# Altium schematic sheet Sheet1.SchDoc
size A0; SheetNumber: 1; SheetTotal: 1
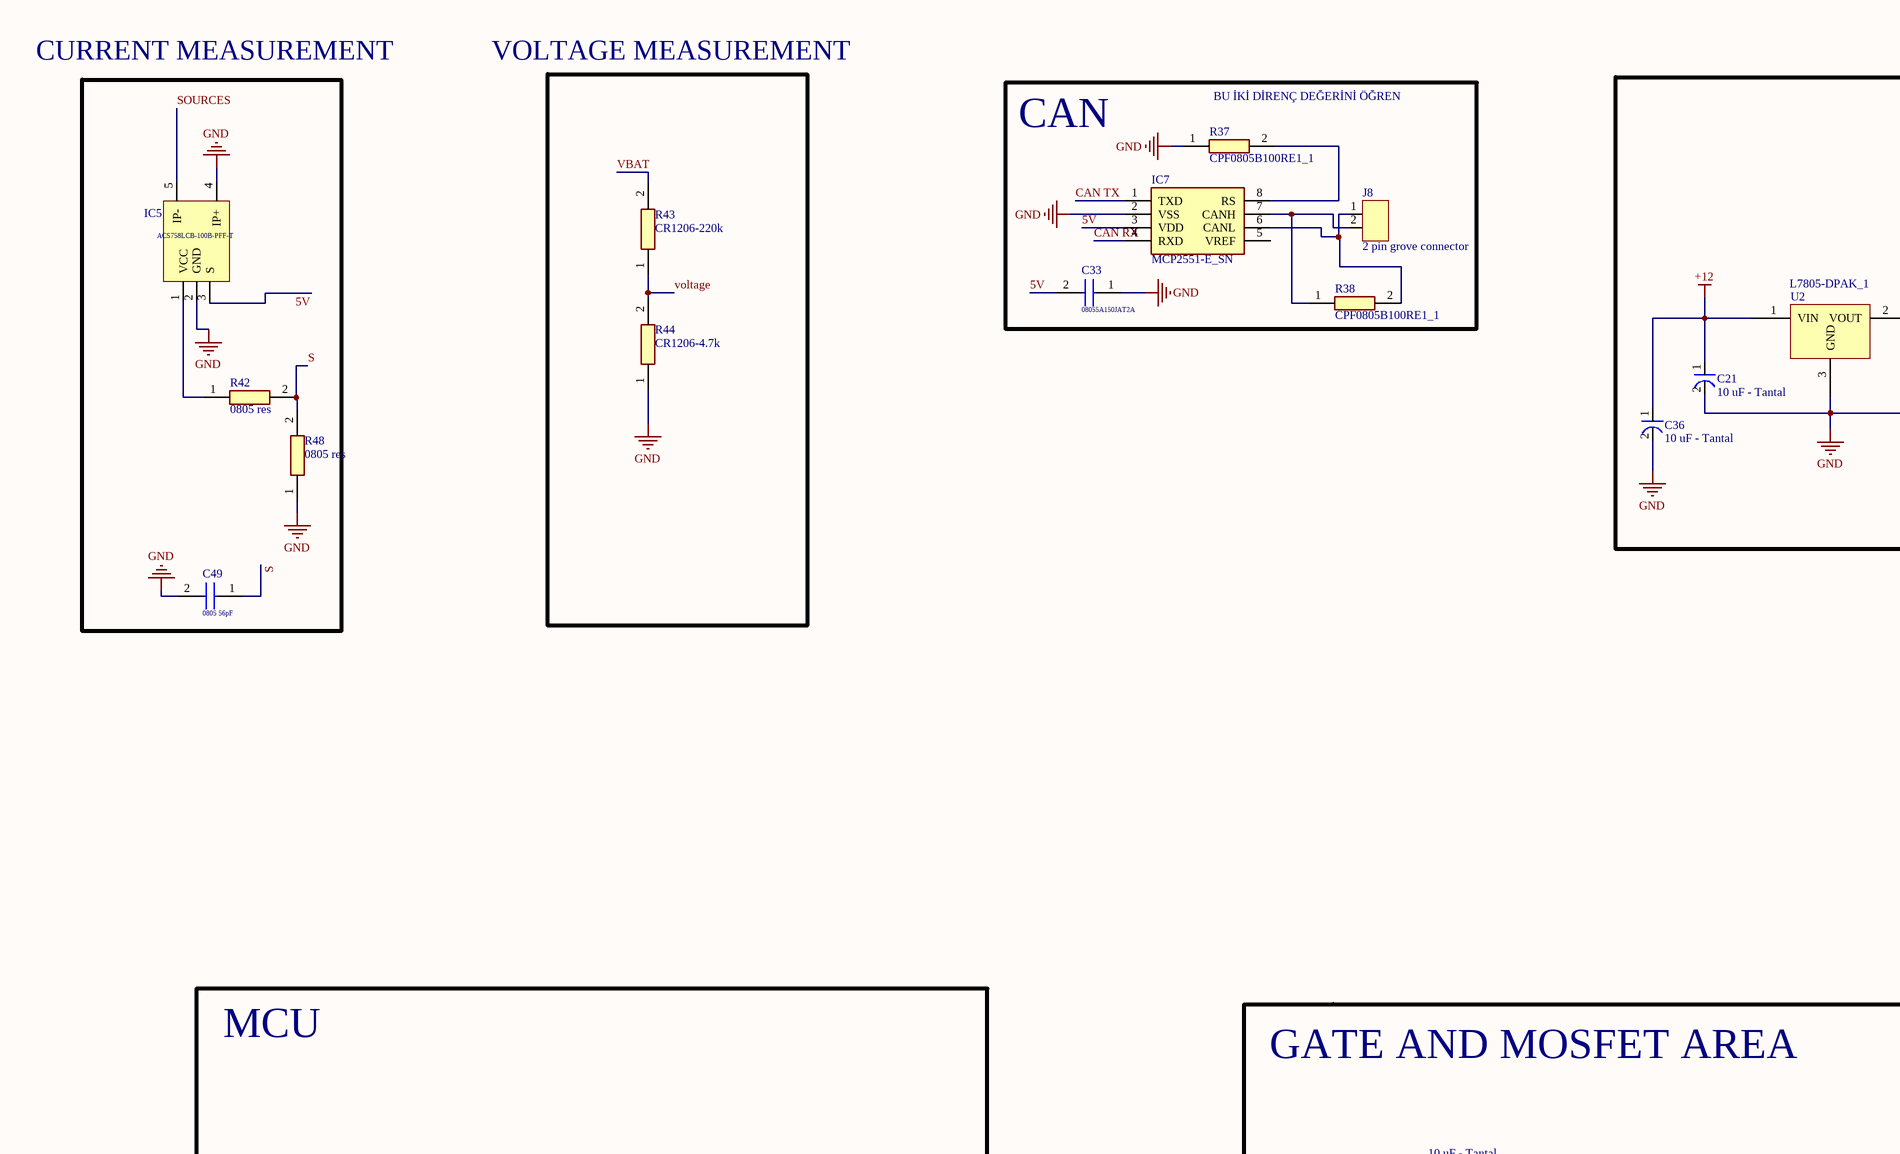
[diagram p0: Sheet1.SchDoc, top left]
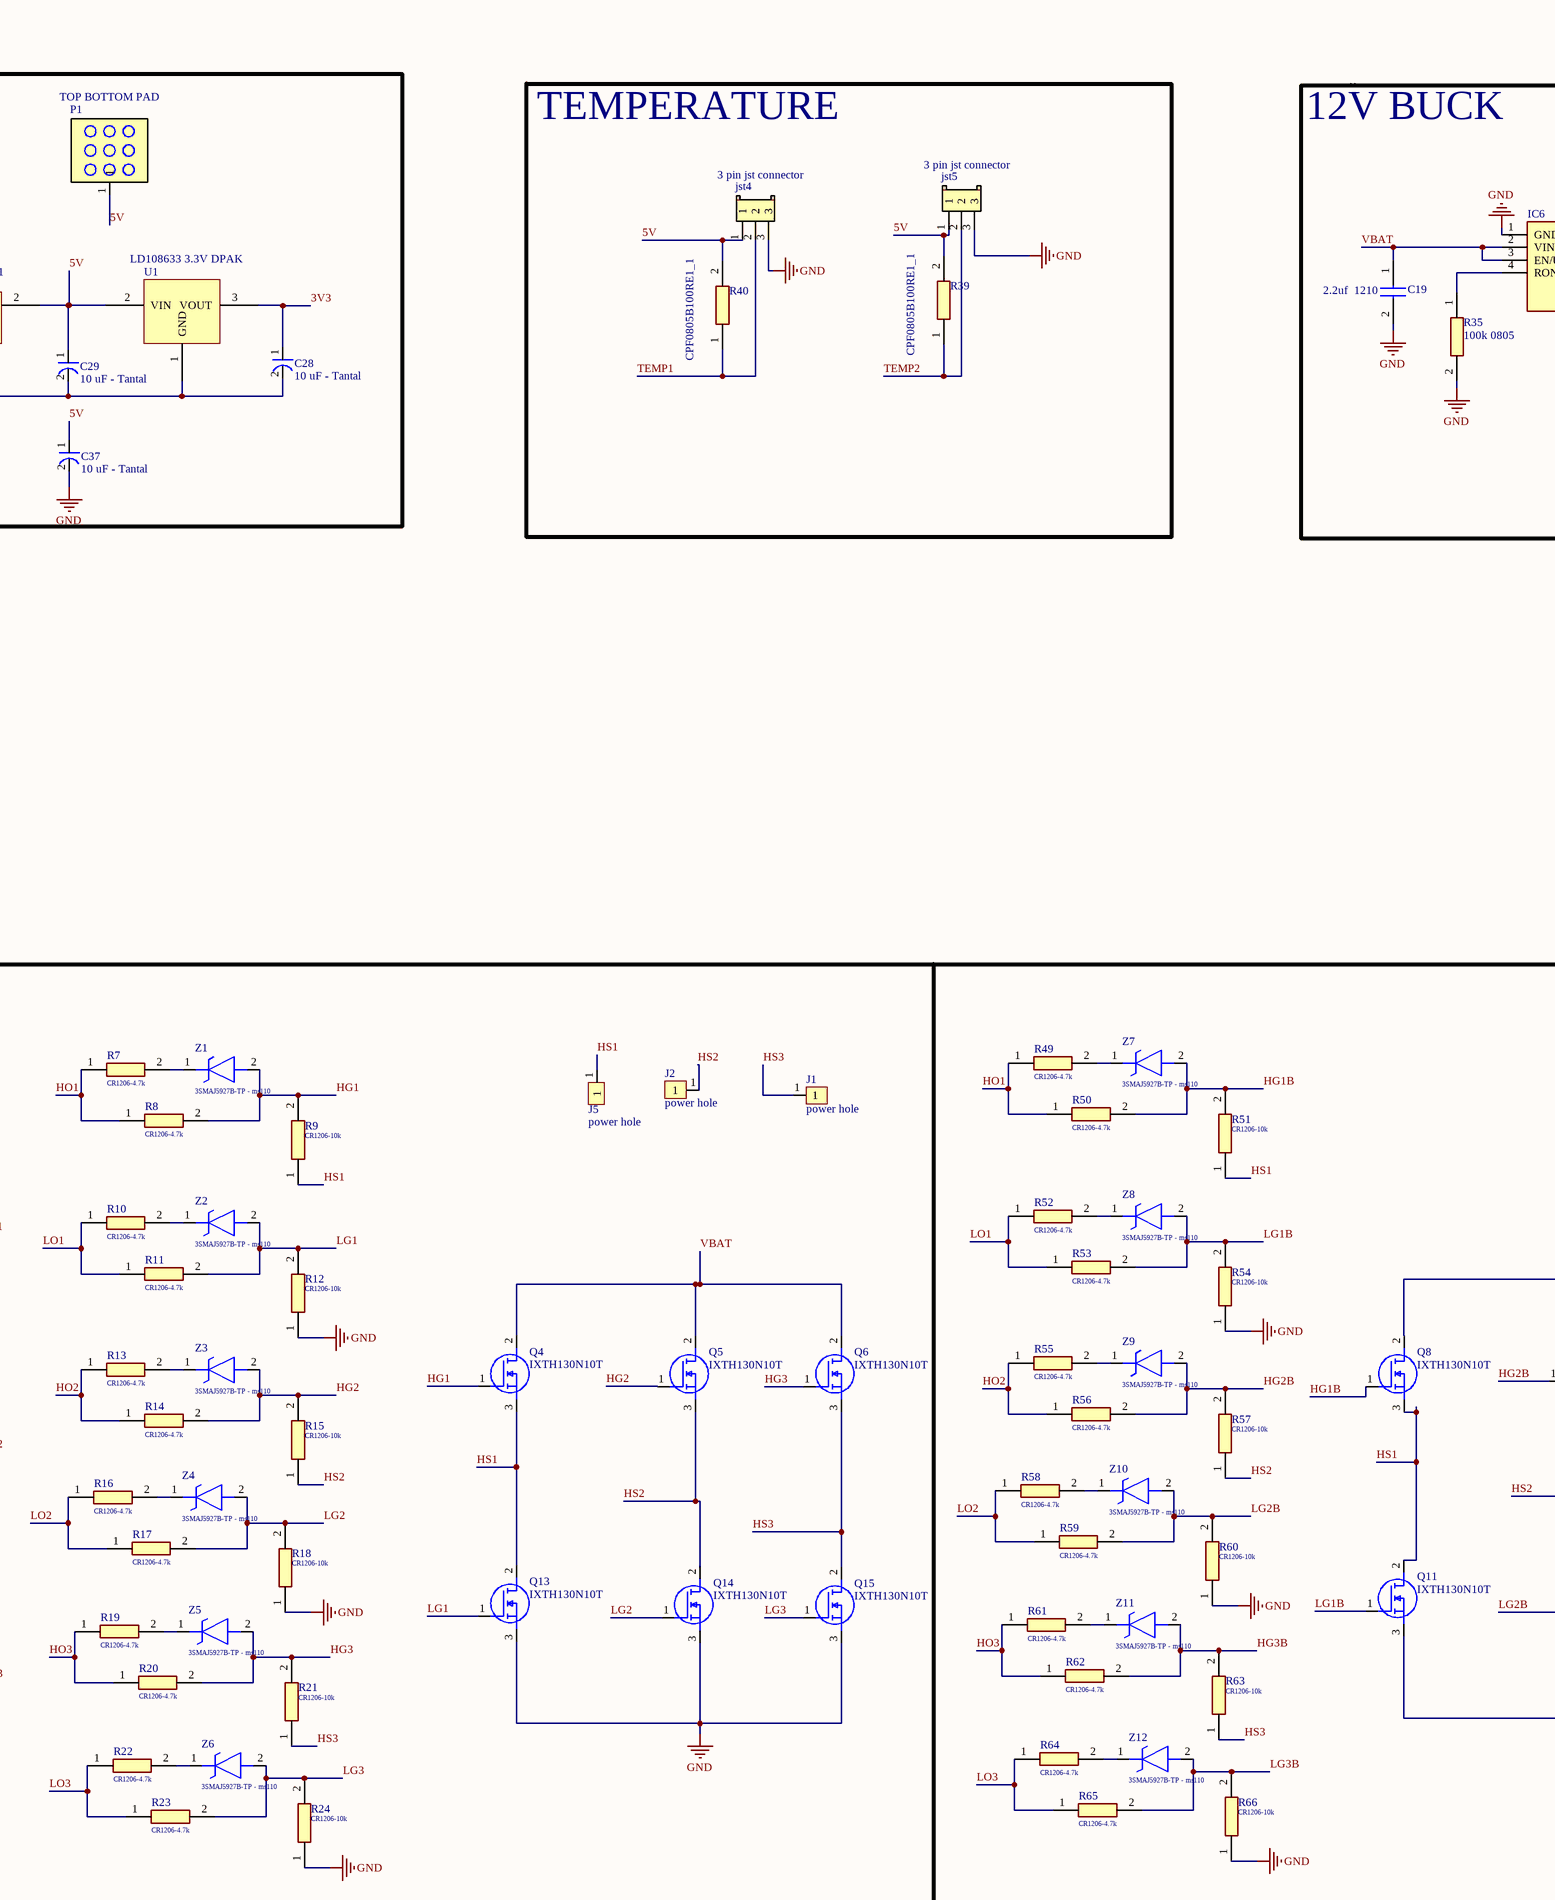
[diagram p1: Sheet1.SchDoc, top middle]
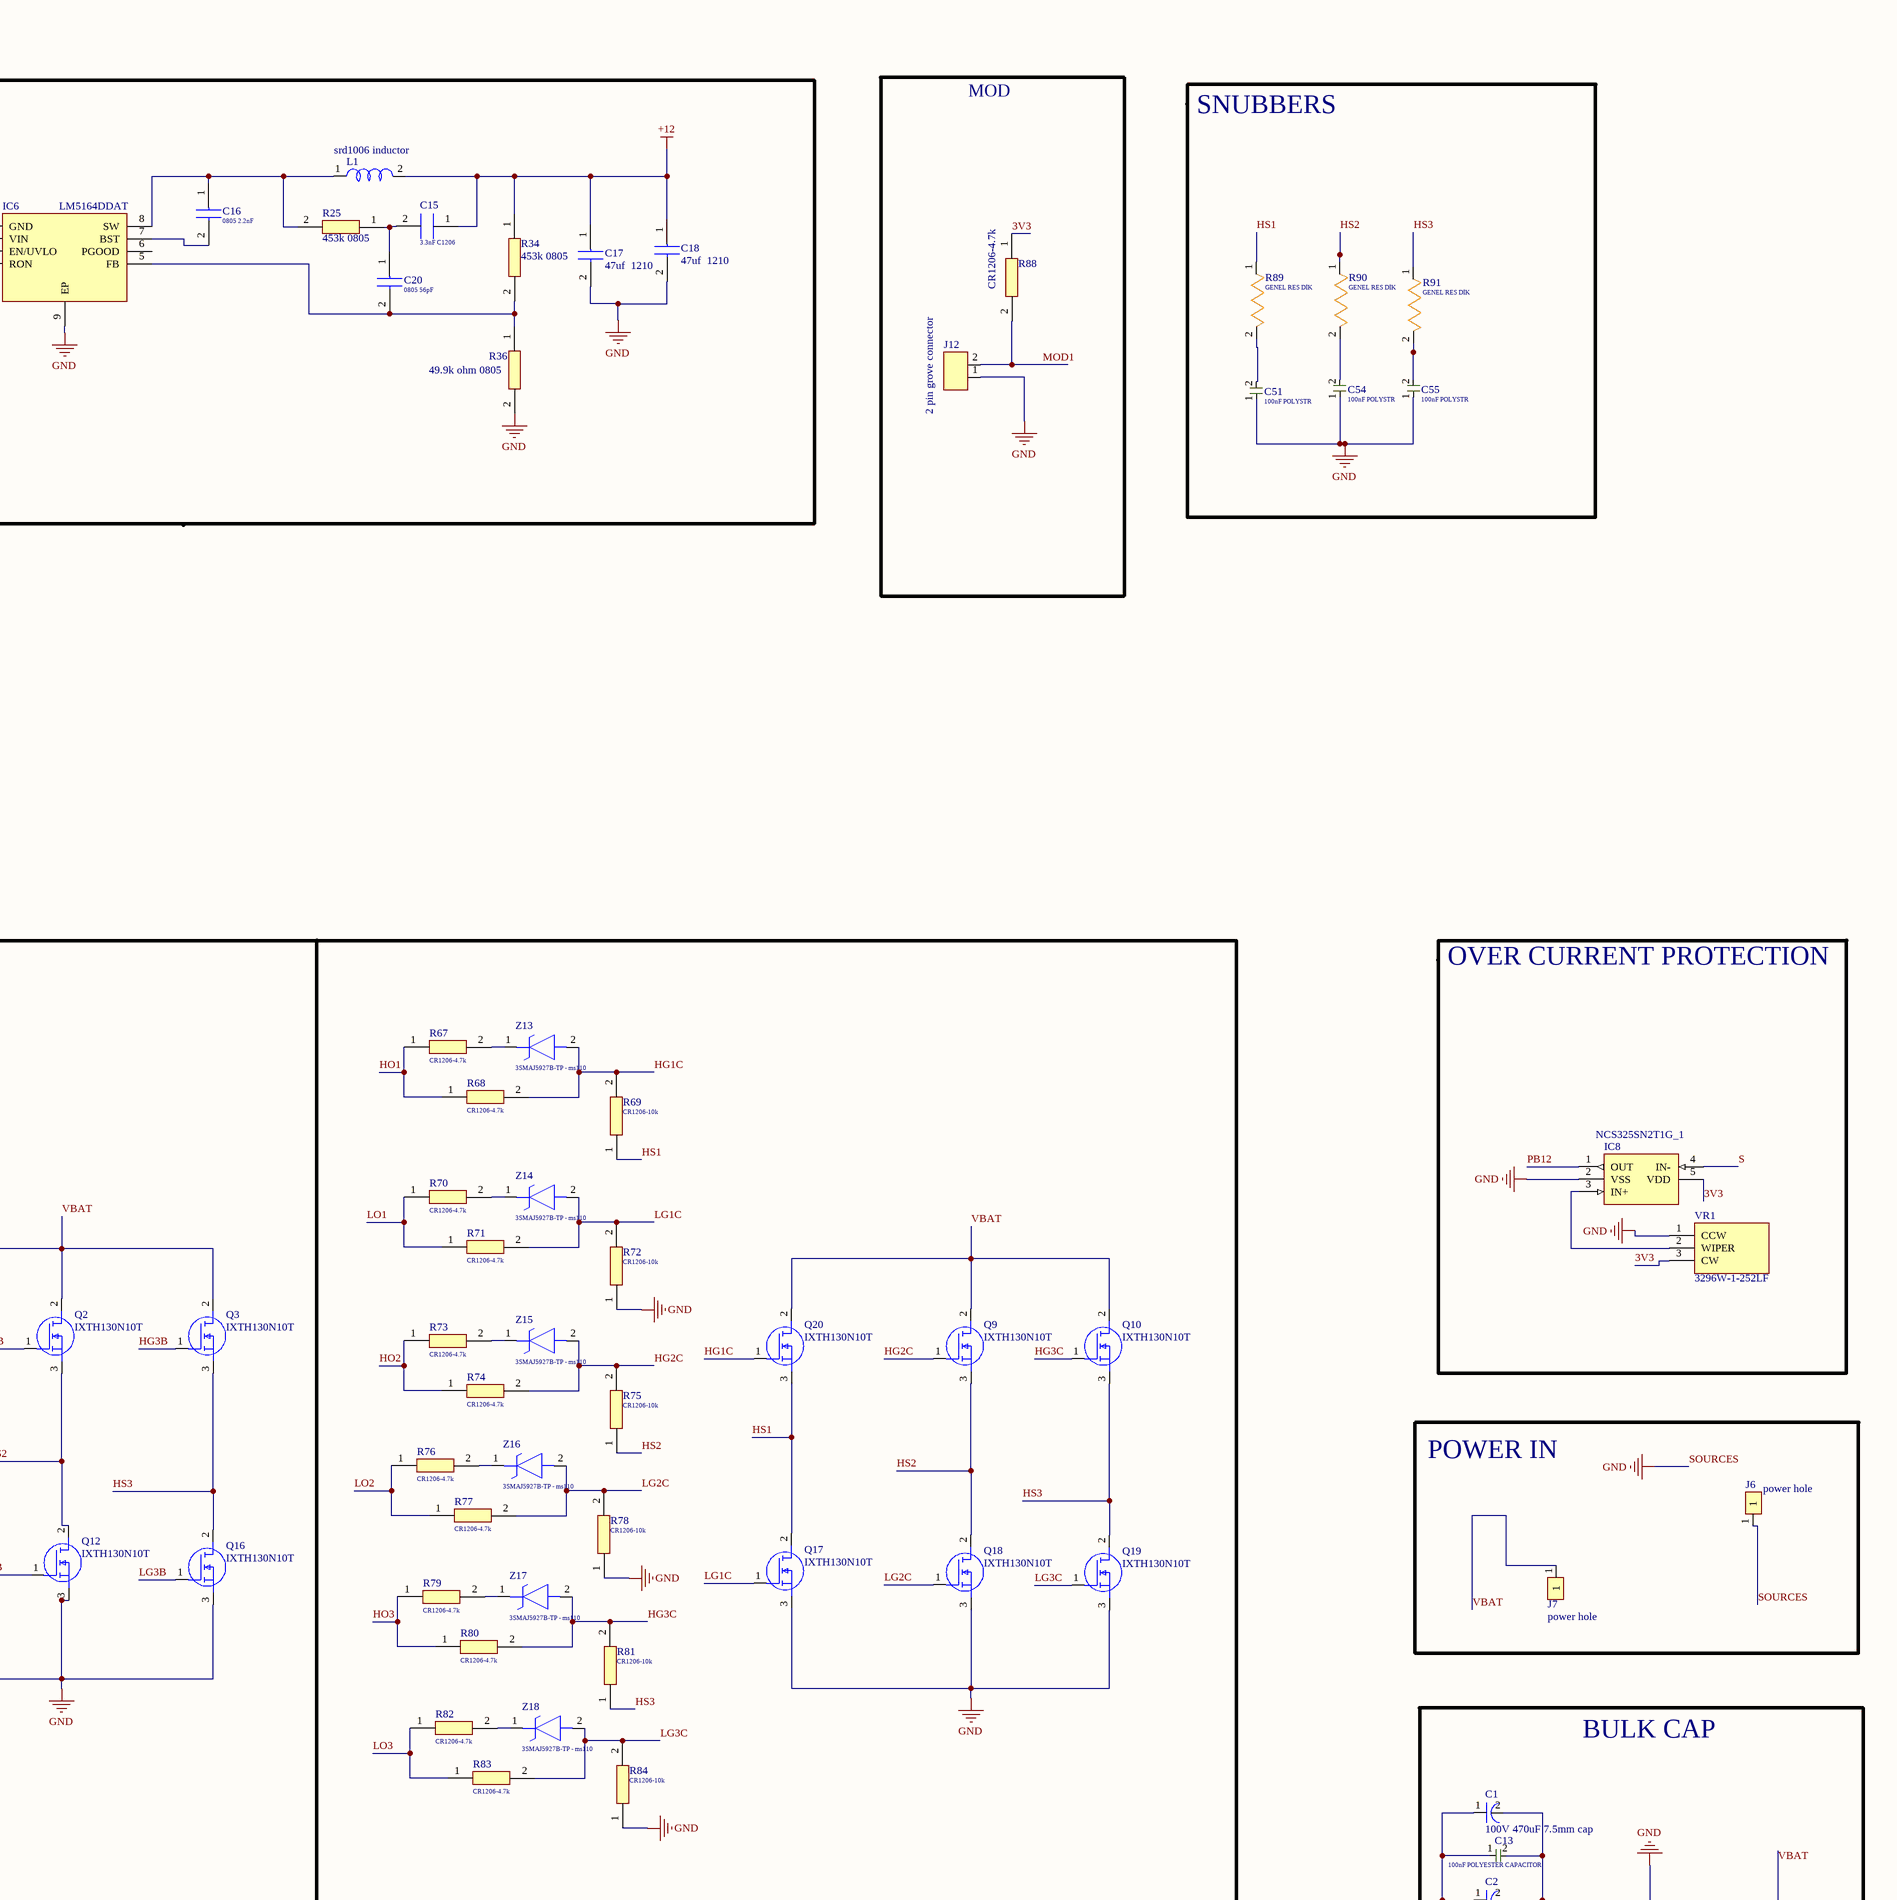
[diagram p2: Sheet1.SchDoc, top right]
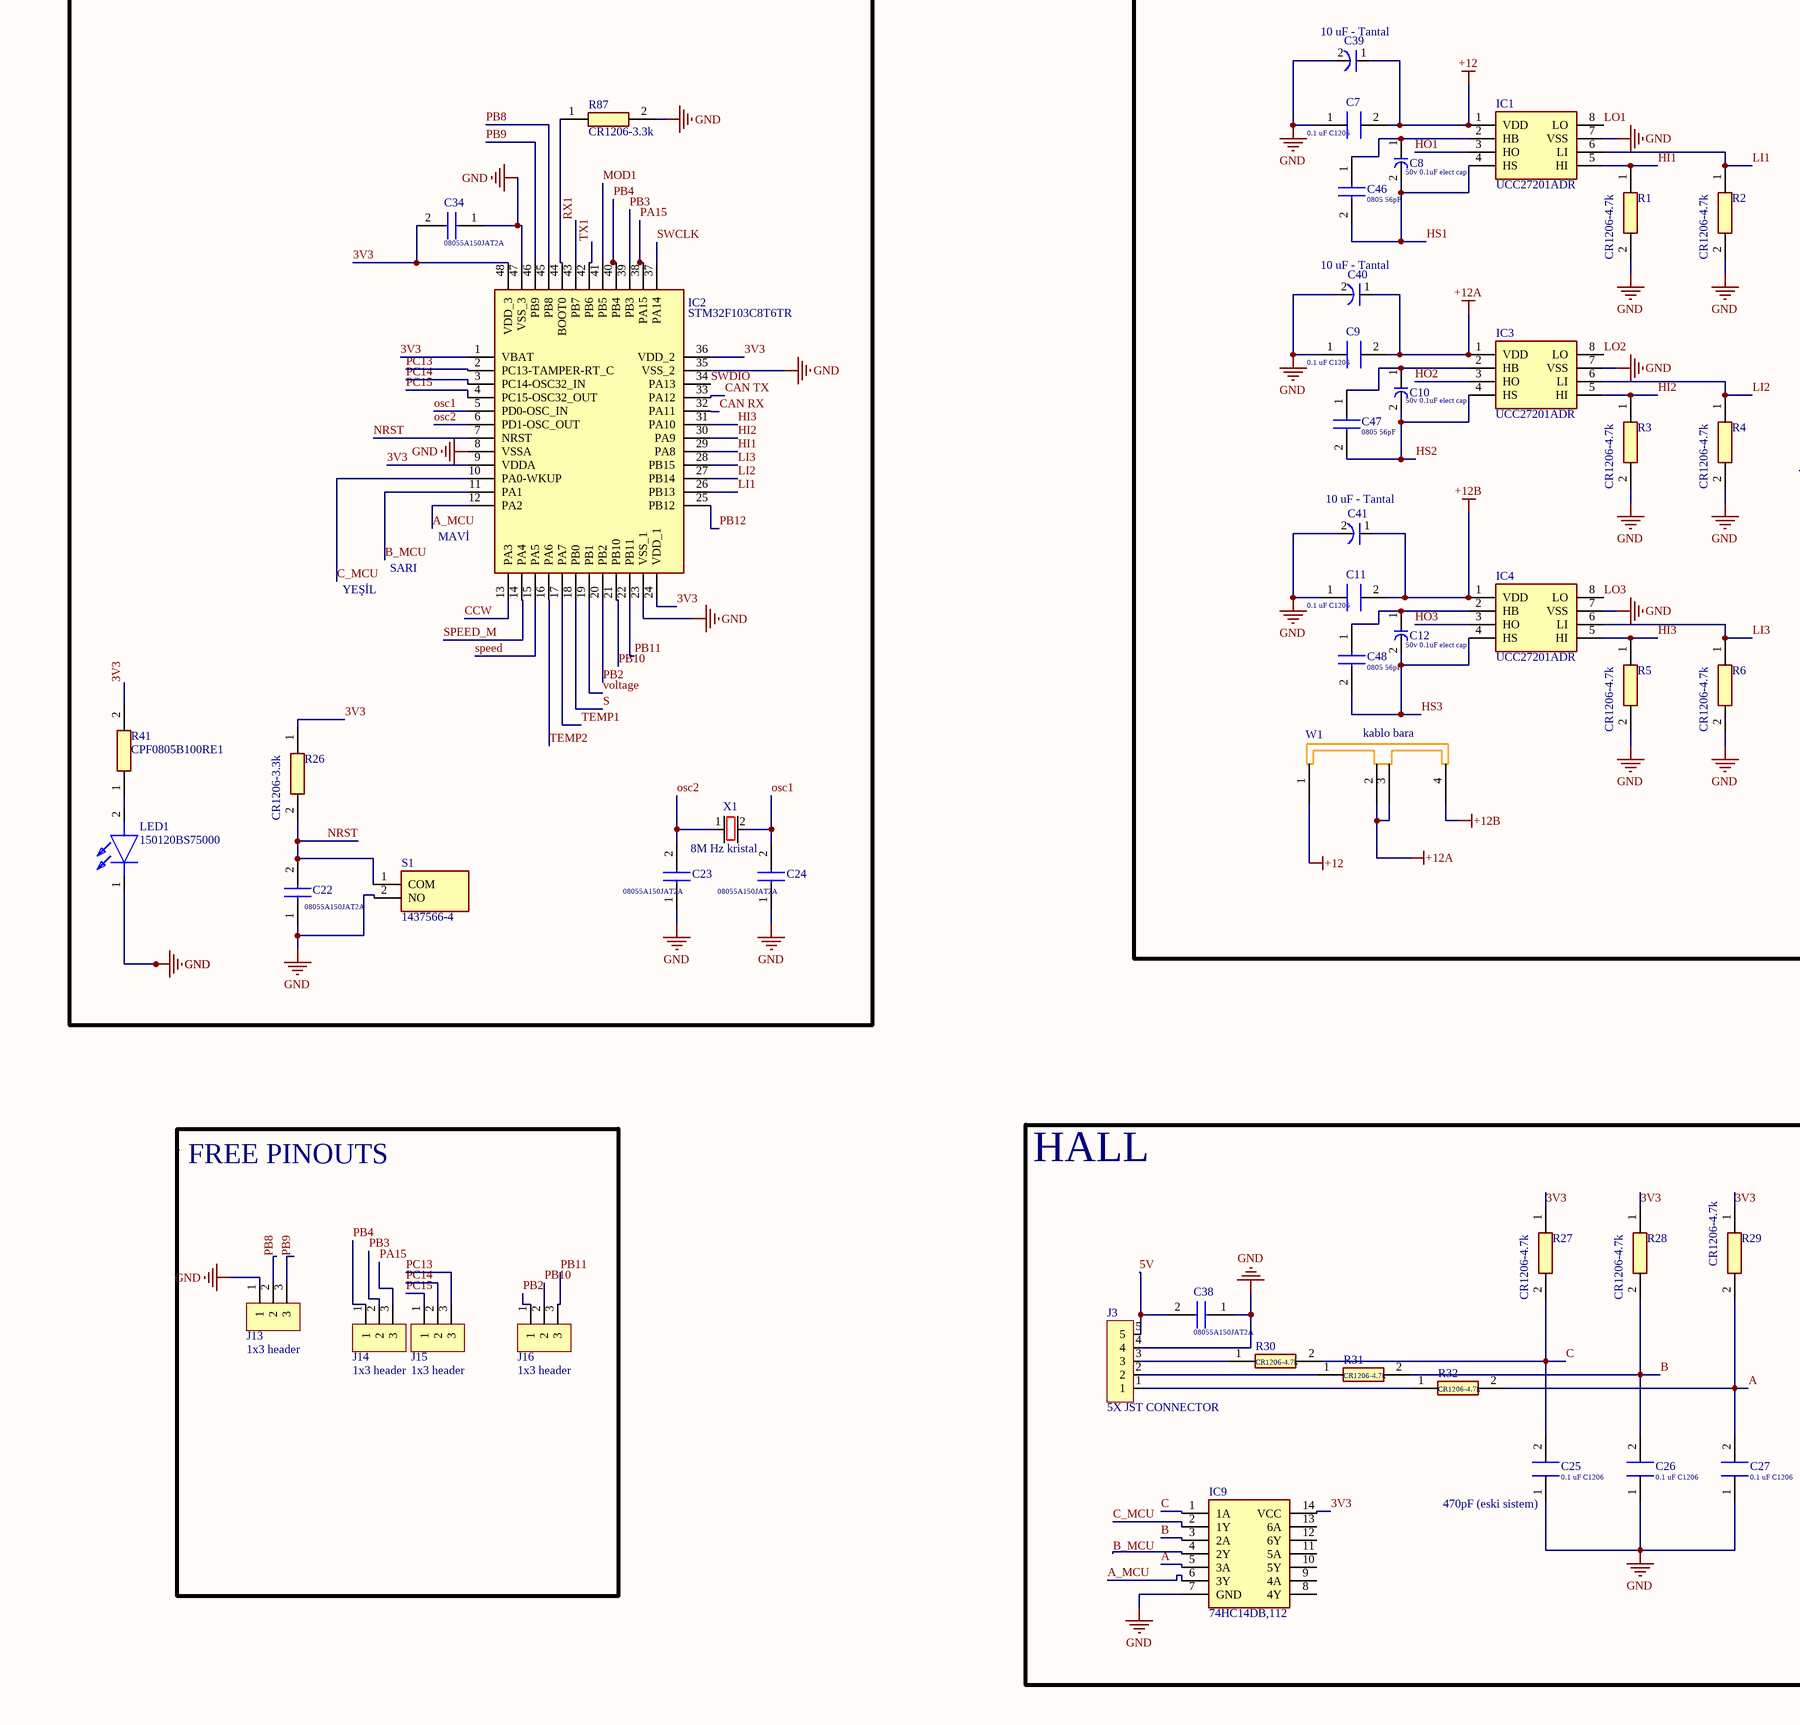
[diagram p3: Sheet1.SchDoc, bottom left]
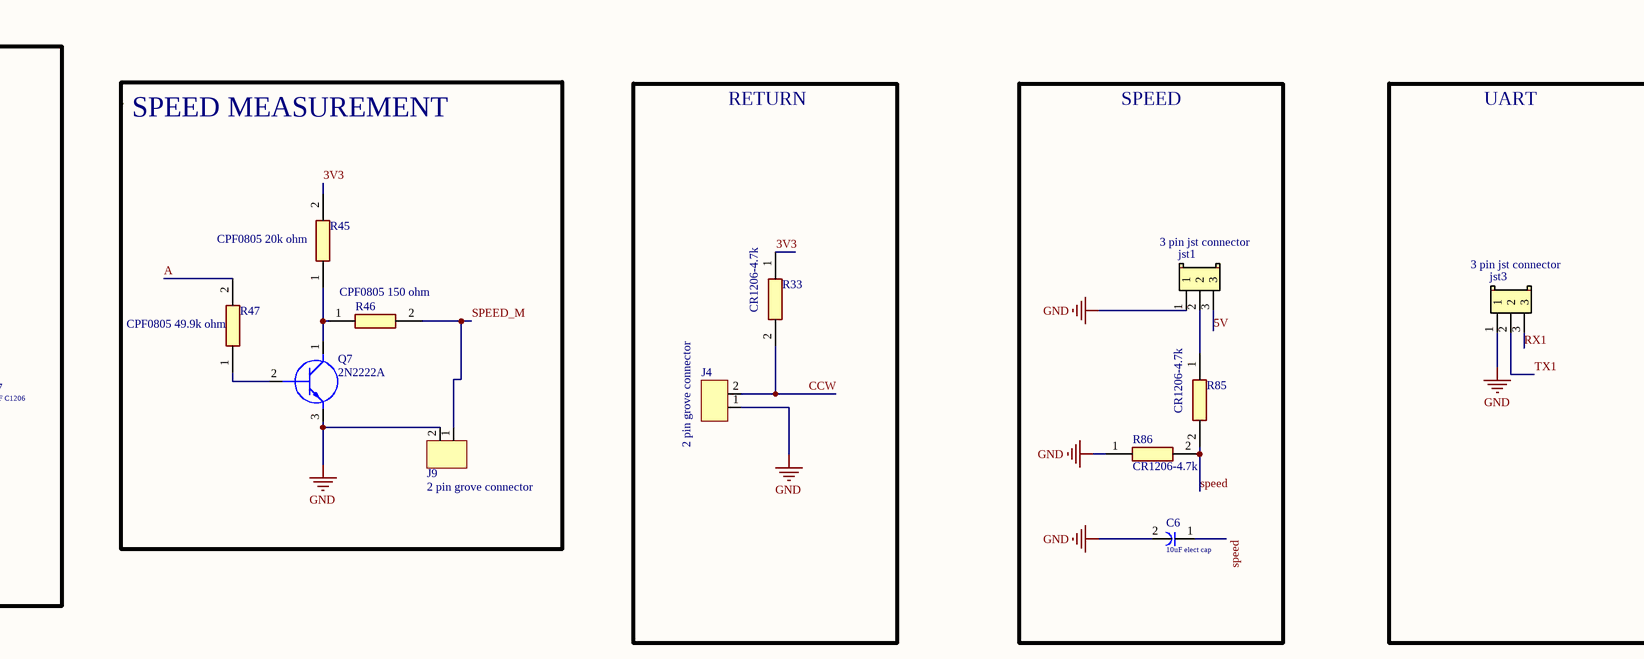
[diagram p4: Sheet1.SchDoc, bottom middle]
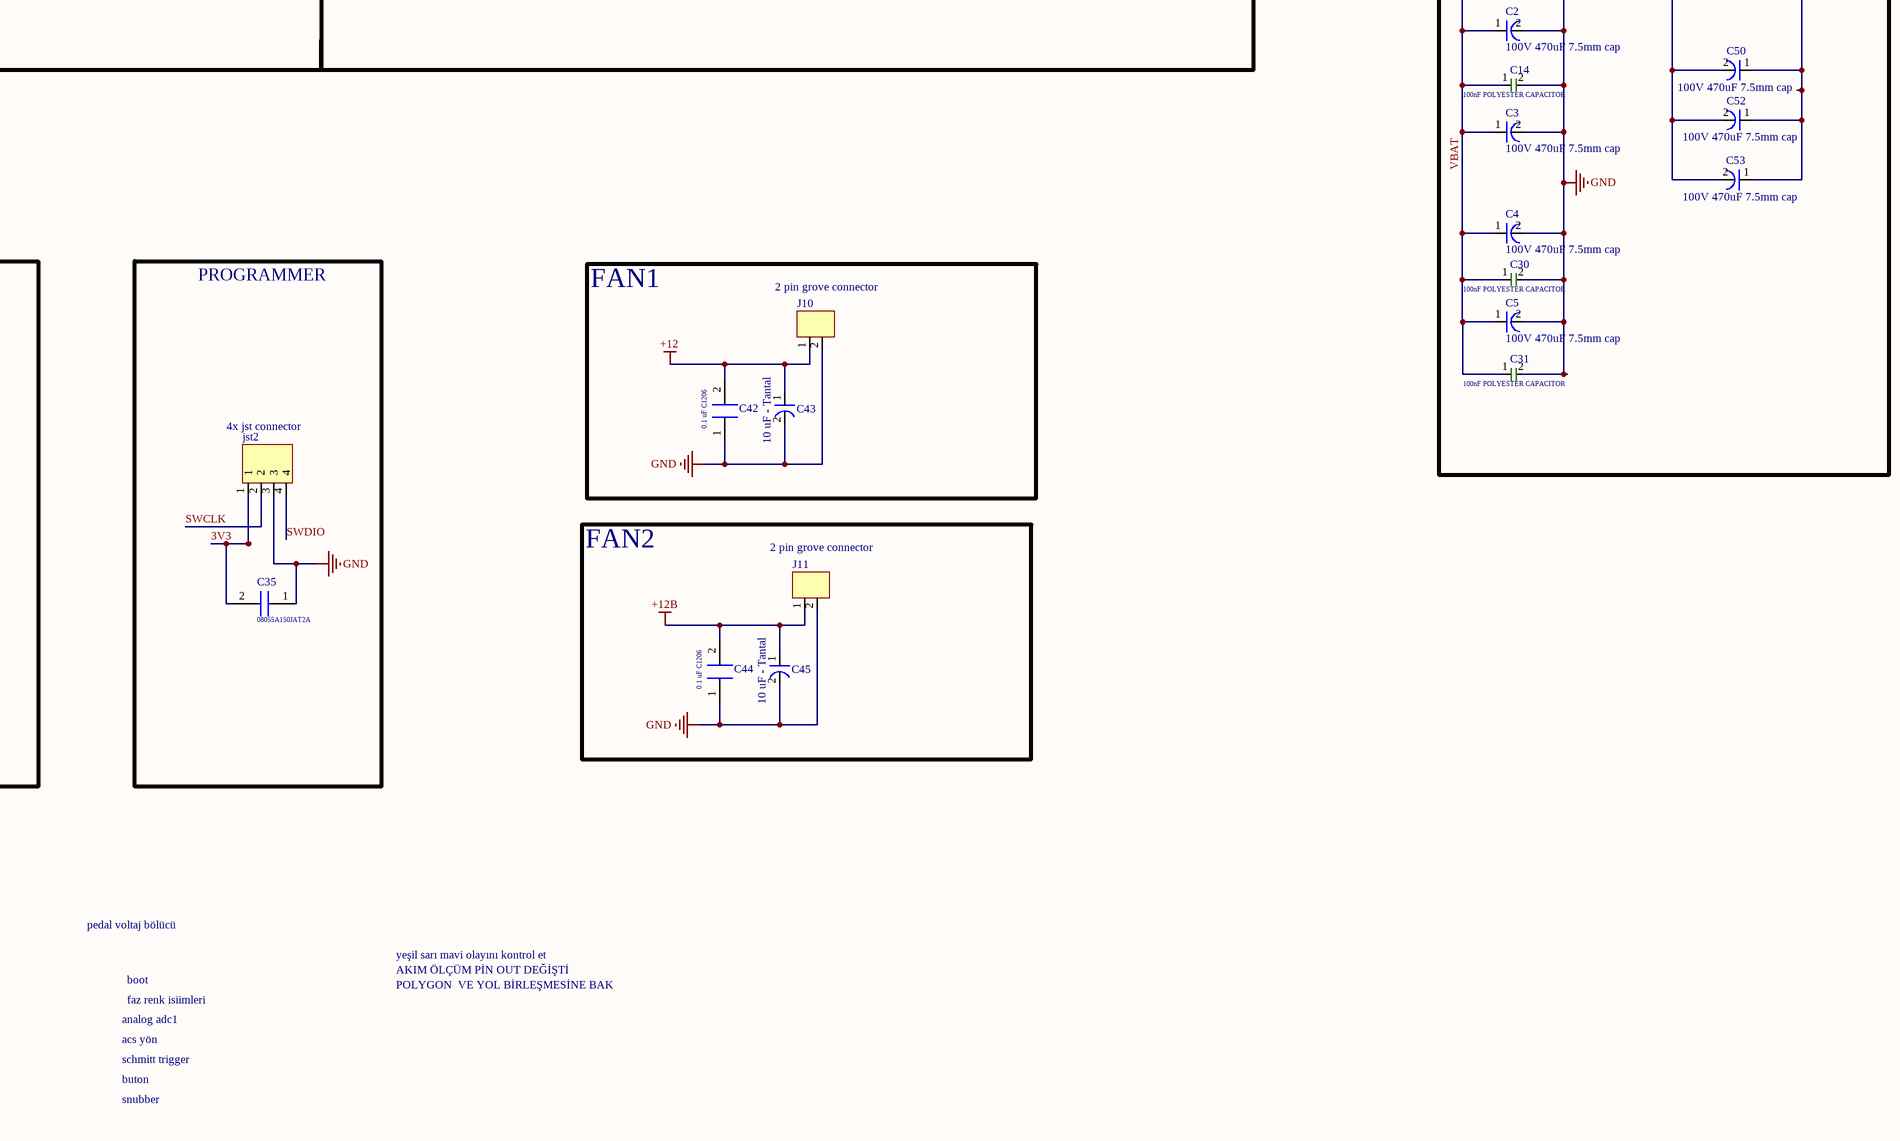
[diagram p5: Sheet1.SchDoc, bottom right]

## Parts
C1  100V 470uF 7.5mm cap  [100v 470UF]
C2  100V 470uF 7.5mm cap  [100v 470UF]
C3  100V 470uF 7.5mm cap  [100v 470UF]
C4  100V 470uF 7.5mm cap  [100v 470UF]
C5  100V 470uF 7.5mm cap  [100v 470UF]
C6  10uF elect cap  [50V 0.1uF elect cap]
C7  0.1 uF C1206  [C1206]
C8  50v 0.1uF elect cap  [50V 0.1uF elect cap]
C9  0.1 uF C1206  [C1206]
C10  50v 0.1uF elect cap  [50V 0.1uF elect cap]
C11  0.1 uF C1206  [C1206]
C12  50v 0.1uF elect cap  [50V 0.1uF elect cap]
C13  100nF POLYESTER CAPACITOR  [100uF POLYESTER CAPACITOR]
C14  100nF POLYESTER CAPACITOR  [100uF POLYESTER CAPACITOR]
C15  3.3nF C1206  [C1206]
C16  0805 2.2nF  [CAPC2012X94N]
C17  47uf  1210  [CAPC3225X270N]
C18  47uf  1210  [CAPC3225X270N]
C19  2.2uf  1210  [CAPC3225X270N]
C20  0805 56pF  [CAPC2012X94N]
C21  10 uF - Tantal  [C1206-TANT]
C22  08055A150JAT2A  [CAPC2012X94N]
C23  08055A150JAT2A  [CAPC2012X94N]
C24  08055A150JAT2A  [CAPC2012X94N]
C25  0.1 uF C1206  [C1206]
C26  0.1 uF C1206  [C1206]
C27  0.1 uF C1206  [C1206]
C28  10 uF - Tantal  [C1206-TANT]
C29  10 uF - Tantal  [C1206-TANT]
C30  100nF POLYESTER CAPACITOR  [100uF POLYESTER CAPACITOR]
C31  100nF POLYESTER CAPACITOR  [100uF POLYESTER CAPACITOR]
C33  08055A150JAT2A  [CAPC2012X94N]
C34  08055A150JAT2A  [CAPC2012X94N]
C35  08055A150JAT2A  [CAPC2012X94N]
C36  10 uF - Tantal  [C1206-TANT]
C37  10 uF - Tantal  [C1206-TANT]
C38  08055A150JAT2A  [CAPC2012X94N]
C39  10 uF - Tantal  [C1206-TANT]
C40  10 uF - Tantal  [C1206-TANT]
C41  10 uF - Tantal  [C1206-TANT]
C42  0.1 uF C1206  [C1206]
C43  10 uF - Tantal  [C1206-TANT]
C44  0.1 uF C1206  [C1206]
C45  10 uF - Tantal  [C1206-TANT]
C46  0805 56pF  [CAPC2012X94N]
C47  0805 56pF  [CAPC2012X94N]
C48  0805 56pF  [CAPC2012X94N]
C49  0805 56pF  [CAPC2012X94N]
C50  100V 470uF 7.5mm cap  [100v 470UF]
C51  100nF POLYSTR  [100uF POLYESTER CAPACITOR]
C52  100V 470uF 7.5mm cap  [100v 470UF]
C53  100V 470uF 7.5mm cap  [100v 470UF]
C54  100nF POLYSTR  [100uF POLYESTER CAPACITOR]
C55  100nF POLYSTR  [100uF POLYESTER CAPACITOR]
IC1  UCC27201ADR  [SOIC127P600X175-8N]
IC2  STM32F103C8T6TR  [QFP50P900X900X160-48N]
IC3  UCC27201ADR  [SOIC127P600X175-8N]
IC4  UCC27201ADR  [SOIC127P600X175-8N]
IC5  ACS758LCB-100B-PFF-T  [ACS772ECB200BPFFT]
IC6  LM5164DDAT  [SOIC127P600X170-9N]
IC7  MCP2551-E_SN  [SOIC127P600X175-8N]
IC8  NCS325SN2T1G_1  [SOT95P275X110-5N]
IC9  74HC14DB,112  [SOIC127P600X175-14N]
J1  power hole  [power hole metric5]
J2  power hole  [power hole metric5]
J3  5X JST CONNECTOR  [5X HEADER]
J4  2 pin grove connector  [2 pin grove connector]
J5  power hole  [power hole metric5]
J6  power hole  [power hole metric5]
J7  power hole  [power hole metric5]
J8  2 pin grove connector  [2 pin grove connector]
J9  2 pin grove connector  [2 pin grove connector]
J10  2 pin grove connector  [2 pin grove connector]
J11  2 pin grove connector  [2 pin grove connector]
J12  2 pin grove connector  [2 pin grove connector]
J13  1x3 header  [1x3 header]
J14  1x3 header  [1x3 header]
J15  1x3 header  [1x3 header]
J16  1x3 header  [1x3 header]
jst1  3 pin jst connector  [3 pin jst connector]
jst2  4x jst connector  [4x jst connector]
jst3  3 pin jst connector  [3 pin jst connector]
jst4  3 pin jst connector  [3 pin jst connector]
jst5  3 pin jst connector  [3 pin jst connector]
L1  srd1006 inductor  [srd1006]
LED1  150120BS75000  [LEDC3214X78N]
P1  TOP BOTTOM PAD  [TOP BOTTOM PAD]
Q2  IXTH130N10T  [IXTH130N10T]
Q3  IXTH130N10T  [IXTH130N10T]
Q4  IXTH130N10T  [IXTH130N10T]
Q5  IXTH130N10T  [IXTH130N10T]
Q6  IXTH130N10T  [IXTH130N10T]
Q7  2N2222A  [2N2222A]
Q8  IXTH130N10T  [IXTH130N10T]
Q9  IXTH130N10T  [IXTH130N10T]
Q10  IXTH130N10T  [IXTH130N10T]
Q11  IXTH130N10T  [IXTH130N10T]
Q12  IXTH130N10T  [IXTH130N10T]
Q13  IXTH130N10T  [IXTH130N10T]
Q14  IXTH130N10T  [IXTH130N10T]
Q15  IXTH130N10T  [IXTH130N10T]
Q16  IXTH130N10T  [IXTH130N10T]
Q17  IXTH130N10T  [IXTH130N10T]
Q18  IXTH130N10T  [IXTH130N10T]
Q19  IXTH130N10T  [IXTH130N10T]
Q20  IXTH130N10T  [IXTH130N10T]
R1  CR1206-4.7k  [RESC3216X75N]
R2  CR1206-4.7k  [RESC3216X75N]
R3  CR1206-4.7k  [RESC3216X75N]
R4  CR1206-4.7k  [RESC3216X75N]
R5  CR1206-4.7k  [RESC3216X75N]
R6  CR1206-4.7k  [RESC3216X75N]
R7  CR1206-4.7k  [RESC3216X75N]
R8  CR1206-4.7k  [RESC3216X75N]
R9  CR1206-10k  [RESC3216X75N]
R10  CR1206-4.7k  [RESC3216X75N]
R11  CR1206-4.7k  [RESC3216X75N]
R12  CR1206-10k  [RESC3216X75N]
R13  CR1206-4.7k  [RESC3216X75N]
R14  CR1206-4.7k  [RESC3216X75N]
R15  CR1206-10k  [RESC3216X75N]
R16  CR1206-4.7k  [RESC3216X75N]
R17  CR1206-4.7k  [RESC3216X75N]
R18  CR1206-10k  [RESC3216X75N]
R19  CR1206-4.7k  [RESC3216X75N]
R20  CR1206-4.7k  [RESC3216X75N]
R21  CR1206-10k  [RESC3216X75N]
R22  CR1206-4.7k  [RESC3216X75N]
R23  CR1206-4.7k  [RESC3216X75N]
R24  CR1206-10k  [RESC3216X75N]
R25  453k 0805  [RESC2012X65N]
R26  CR1206-3.3k  [RESC3216X75N]
R27  CR1206-4.7k  [RESC3216X75N]
R28  CR1206-4.7k  [RESC3216X75N]
R29  CR1206-4.7k  [RESC3216X75N]
R30  CR1206-4.7k  [RESC3216X75N]
R31  CR1206-4.7k  [RESC3216X75N]
R32  CR1206-4.7k  [RESC3216X75N]
R33  CR1206-4.7k  [RESC3216X75N]
R34  453k 0805  [RESC2012X65N]
R35  100k 0805  [RESC2012X65N]
R36  49.9k ohm 0805  [RESC2012X65N]
R37  CPF0805B100RE1_1  [RESC2012X65N]
R38  CPF0805B100RE1_1  [RESC2012X65N]
R39  CPF0805B100RE1_1  [RESC2012X65N]
R40  CPF0805B100RE1_1  [RESC2012X65N]
R41  CPF0805B100RE1  [RESC2012X65N]
R42  0805 res  [RESC2012X65N]
R43  CR1206-220k  [RESC3216X75N]
R44  CR1206-4.7k  [RESC3216X75N]
R45  CPF0805 20k ohm  [RESC2012X65N]
R46  CPF0805 150 ohm  [RESC2012X65N]
R47  CPF0805 49.9k ohm  [RESC2012X65N]
R48  0805 res  [RESC2012X65N]
R49  CR1206-4.7k  [RESC3216X75N]
R50  CR1206-4.7k  [RESC3216X75N]
R51  CR1206-10k  [RESC3216X75N]
R52  CR1206-4.7k  [RESC3216X75N]
R53  CR1206-4.7k  [RESC3216X75N]
R54  CR1206-10k  [RESC3216X75N]
R55  CR1206-4.7k  [RESC3216X75N]
R56  CR1206-4.7k  [RESC3216X75N]
R57  CR1206-10k  [RESC3216X75N]
R58  CR1206-4.7k  [RESC3216X75N]
R59  CR1206-4.7k  [RESC3216X75N]
R60  CR1206-10k  [RESC3216X75N]
R61  CR1206-4.7k  [RESC3216X75N]
R62  CR1206-4.7k  [RESC3216X75N]
R63  CR1206-10k  [RESC3216X75N]
R64  CR1206-4.7k  [RESC3216X75N]
R65  CR1206-4.7k  [RESC3216X75N]
R66  CR1206-10k  [RESC3216X75N]
R67  CR1206-4.7k  [RESC3216X75N]
R68  CR1206-4.7k  [RESC3216X75N]
R69  CR1206-10k  [RESC3216X75N]
R70  CR1206-4.7k  [RESC3216X75N]
R71  CR1206-4.7k  [RESC3216X75N]
R72  CR1206-10k  [RESC3216X75N]
R73  CR1206-4.7k  [RESC3216X75N]
R74  CR1206-4.7k  [RESC3216X75N]
R75  CR1206-10k  [RESC3216X75N]
R76  CR1206-4.7k  [RESC3216X75N]
R77  CR1206-4.7k  [RESC3216X75N]
R78  CR1206-10k  [RESC3216X75N]
R79  CR1206-4.7k  [RESC3216X75N]
R80  CR1206-4.7k  [RESC3216X75N]
R81  CR1206-10k  [RESC3216X75N]
R82  CR1206-4.7k  [RESC3216X75N]
R83  CR1206-4.7k  [RESC3216X75N]
R84  CR1206-10k  [RESC3216X75N]
R85  CR1206-4.7k  [RESC3216X75N]
R86  CR1206-4.7k  [RESC3216X75N]
R87  CR1206-3.3k  [RESC3216X75N]
R88  CR1206-4.7k  [RESC3216X75N]
R89  GENEL RES DİK  [DİK GENEL RES THT]
R90  GENEL RES DİK  [DİK GENEL RES THT]
R91  GENEL RES DİK  [DİK GENEL RES THT]
S1  1437566-4  [14375664]
U1  LD108633 3.3V DPAK  [DPAK228P972X240-3N]
U2  L7805-DPAK_1  [DPAK228P972X240-3N]
VR1  3296W-1-252LF  [3296W-1]
W1  kablo bara  [KABLO BARA]
X1  8M Hz kristal  [8M Hz kristal]
Z1  3SMAJ5927B-TP - ms110  [DIOM5226X244N]
Z2  3SMAJ5927B-TP - ms110  [DIOM5226X244N]
Z3  3SMAJ5927B-TP - ms110  [DIOM5226X244N]
Z4  3SMAJ5927B-TP - ms110  [DIOM5226X244N]
Z5  3SMAJ5927B-TP - ms110  [DIOM5226X244N]
Z6  3SMAJ5927B-TP - ms110  [DIOM5226X244N]
Z7  3SMAJ5927B-TP - ms110  [DIOM5226X244N]
Z8  3SMAJ5927B-TP - ms110  [DIOM5226X244N]
Z9  3SMAJ5927B-TP - ms110  [DIOM5226X244N]
Z10  3SMAJ5927B-TP - ms110  [DIOM5226X244N]
Z11  3SMAJ5927B-TP - ms110  [DIOM5226X244N]
Z12  3SMAJ5927B-TP - ms110  [DIOM5226X244N]
Z13  3SMAJ5927B-TP - ms110  [DIOM5226X244N]
Z14  3SMAJ5927B-TP - ms110  [DIOM5226X244N]
Z15  3SMAJ5927B-TP - ms110  [DIOM5226X244N]
Z16  3SMAJ5927B-TP - ms110  [DIOM5226X244N]
Z17  3SMAJ5927B-TP - ms110  [DIOM5226X244N]
Z18  3SMAJ5927B-TP - ms110  [DIOM5226X244N]

## Blocks framed on the sheet
CAN: C33 IC7 J8 R37 R38
TEMPERATURE: jst4 jst5 R39 R40
MOD: J12 R88
SNUBBERS: C51 C54 C55 R89-R91
MCU: C22-C24 C34 IC2 LED1 R26 R41 R87 S1 X1
GATE AND MOSFET AREA: C7-C12 C39-C41 C46-C48 IC1 IC3 IC4 J1 J2 J5 Q4-Q6 Q13-Q15 R1-R24 W1 Z1-Z6
OVER CURRENT PROTECTION: IC8 VR1
POWER IN: J6 J7
BULK CAP: C1-C5 C13 C14 C30 C31 C50 C52 C53
FREE PINOUTS: J13-J16
HALL: C25-C27 C38 IC9 J3 R27-R32
SPEED MEASUREMENT: J9 Q7 R45-R47
RETURN: J4 R33
SPEED: C6 jst1 R85 R86
UART: jst3
PROGRAMMER: C35 jst2
FAN1: C42 C43 J10
FAN2: C44 C45 J11

## Nets
+12: C7.2 C15.1 C17.1 C18.1 C21.1 C36.1 C39.1 C42.2 C43.1 IC1.1(VDD) J10.1 L1.2 R34.1 U2.1(VIN) W1.1
+12A: C9.2 C40.1 IC3.1(VDD) W1.2 W1.3
+12B: C11.2 C41.1 C44.2 C45.1 IC4.1(VDD) J11.1 W1.4
SOURCES: C1.2 C2.2 C3.2 C4.2 C5.2 C6.2 C7.1 C9.1 C11.1 C13.2 C14.2 C17.2 C18.2 C19.2 C21.2 C22.1 C23.1 C24.1 C25.1 C26.1 C27.1 C28.2 C29.2 C30.2 C31.2 C33.1 C34.1 C35.1 C36.2 C37.2 C38.1 C39.2 C40.2 C41.2 C42.1 C43.2 C44.1 C45.2 C49.2 C50.2 C51.1 C52.2 C53.2 C54.1 C55.1 IC1.7(VSS) IC2.8(VSSA) IC2.23(VSS_1) IC2.35(VSS_2) IC2.47(VSS_3) IC3.7(VSS) IC4.7(VSS) IC5.2(GND) IC5.4(IP+) IC5.5(IP-) IC6.1(GND) IC6.9(EP) IC7.2(VSS) IC8.2(VSS) IC9.7(GND) J3.4 J4.1 J6.1 J9.2 J10.2 J11.2 J12.1 J13.1 jst1.1 jst2.3 jst3.1 jst4.3 jst5.3 LED1.1(K) Q7.3(E) Q11.3(S) Q12.3(S) Q13.3(S) Q14.3(S) Q15.3(S) Q16.3(S) Q17.3(S) Q18.3(S) Q19.3(S) R1.2 R2.2 R3.2 R4.2 R5.2 R6.2 R12.1 R18.1 R24.1 R35.2 R36.2 R37.1 R44.1 R48.1 R54.1 R60.1 R66.1 R72.1 R78.1 R84.1 R86.1 R87.2 S1.2(NO) U1.1(GND) U2.3(GND) VR1.1(CCW)  [also labelled GND]
3V3: C28.1 C34.2 C35.2 IC2.1(VBAT) IC2.9(VDDA) IC2.24(VDD_1) IC2.36(VDD_2) IC2.48(VDD_3) IC8.5(VDD) IC9.14(VCC) jst2.1 R26.1 R27.1 R28.1 R29.1 R33.1 R41.2 R45.2 R88.1 U1.3(VOUT) VR1.3(CW)
5V: C29.1 C33.2 C37.1 C38.2 IC5.3(S) IC7.3(VDD) J3.5 jst1.3 jst4.1 jst5.1 P1.1 R39.2 R40.2 U1.2(VIN) U2.2(VOUT)
A: C27.2 IC9.5(3A) R29.2 R32.2 R47.2
A_MCU: IC2.12(PA2) IC9.6(3Y)
B: C26.2 IC9.3(2A) R28.2 R31.2
B_MCU: IC2.11(PA1) IC9.4(2Y)
C: C25.2 IC9.1(1A) R27.2 R30.2
C_MCU: IC2.10(PA0-WKUP) IC9.2(1Y)
CAN RX: IC2.32(PA11) IC7.4(RXD)
CAN TX: IC2.33(PA12) IC7.1(TXD)
CCW: IC2.13(PA3) J4.2 R33.2
HG1: Q4.1(G) R8.2 R9.2 Z1.2(A)
HG1B: Q8.1(G) R50.2 R51.2 Z7.2(A)
HG1C: Q20.1(G) R68.2 R69.2 Z13.2(A)
HG2: Q5.1(G) R14.2 R15.2 Z3.2(A)
HG2B: Q2.1(G) R56.2 R57.2 Z9.2(A)
HG2C: Q9.1(G) R74.2 R75.2 Z15.2(A)
HG3: Q6.1(G) R20.2 R21.2 Z5.2(A)
HG3B: Q3.1(G) R62.2 R63.2 Z11.2(A)
HG3C: Q10.1(G) R80.2 R81.2 Z17.2(A)
HI1: IC1.5(HI) IC2.29(PA8) R1.1
HI2: IC2.30(PA9) IC3.5(HI) R3.1
HI3: IC2.31(PA10) IC4.5(HI) R5.1
HO1: IC1.3(HO) R7.1 R8.1 R49.1 R50.1 R67.1 R68.1
HO2: IC3.3(HO) R13.1 R14.1 R55.1 R56.1 R73.1 R74.1
HO3: IC4.3(HO) R19.1 R20.1 R61.1 R62.1 R79.1 R80.1
HS1: C8.2 C46.2 IC1.4(HS) J5.1 Q4.3(S) Q8.3(S) Q11.2(D) Q13.2(D) Q17.2(D) Q20.3(S) R9.1 R51.1 R69.1 R89.1
HS2: C10.2 C47.2 IC3.4(HS) J2.1 Q2.3(S) Q5.3(S) Q9.3(S) Q12.2(D) Q14.2(D) Q18.2(D) R15.1 R57.1 R75.1 R90.1
HS3: C12.2 C48.2 IC4.4(HS) J1.1 Q3.3(S) Q6.3(S) Q10.3(S) Q15.2(D) Q16.2(D) Q19.2(D) R21.1 R63.1 R81.1 R91.1
LG1: Q13.1(G) R11.2 R12.2 Z2.2(A)
LG1B: Q11.1(G) R53.2 R54.2 Z8.2(A)
LG1C: Q17.1(G) R71.2 R72.2 Z14.2(A)
LG2: Q14.1(G) R17.2 R18.2 Z4.2(A)
LG2B: Q12.1(G) R59.2 R60.2 Z10.2(A)
LG2C: Q18.1(G) R77.2 R78.2 Z16.2(A)
LG3: Q15.1(G) R23.2 R24.2 Z6.2(A)
LG3B: Q16.1(G) R65.2 R66.2 Z12.2(A)
LG3C: Q19.1(G) R83.2 R84.2 Z18.2(A)
LI1: IC1.6(LI) IC2.26(PB13) R2.1
LI2: IC2.27(PB14) IC3.6(LI) R4.1
LI3: IC2.28(PB15) IC4.6(LI) R6.1
LO1: IC1.8(LO) R10.1 R11.1 R52.1 R53.1 R70.1 R71.1
LO2: IC3.8(LO) R16.1 R17.1 R58.1 R59.1 R76.1 R77.1
LO3: IC4.8(LO) R22.1 R23.1 R64.1 R65.1 R82.1 R83.1
MOD1: IC2.41(PB5) J12.2 R88.2
NRST: C22.2 IC2.7(NRST) R26.2 S1.1(COM)
osc1: C24.2 IC2.5(PD0-OSC_IN) X1.2
osc2: C23.2 IC2.6(PD1-OSC_OUT) X1.1
PA15: IC2.38(PA15) J14.3
PB2: IC2.20(PB2) J16.1
PB3: IC2.39(PB3) J14.2
PB4: IC2.40(PB4) J14.1
PB8: IC2.45(PB8) J13.2
PB9: IC2.46(PB9) J13.3
PB10: IC2.21(PB10) J16.2
PB11: IC2.22(PB11) J16.3
PB12: IC2.25(PB12) IC8.1(OUT)
PC13: IC2.2(PC13-TAMPER-RT_C) J15.3
PC14: IC2.3(PC14-OSC32_IN) J15.2
PC15: IC2.4(PC15-OSC32_OUT) J15.1
RX1: IC2.43(PB7) jst3.3
S: C49.1 IC2.18(PB0) IC8.4(IN-) R42.2 R48.2
speed: C6.1 IC2.15(PA5) R85.2 R86.2
SPEED_M: IC2.14(PA4) J9.1 R46.2
SWCLK: IC2.37(PA14) jst2.2
SWDIO: IC2.34(PA13) jst2.4
TEMP1: IC2.17(PA7) jst4.2 R40.1
TEMP2: IC2.16(PA6) jst5.2 R39.1
TX1: IC2.42(PB6) jst3.2
VBAT: C1.1 C2.1 C3.1 C4.1 C5.1 C13.1 C14.1 C19.1 C30.1 C31.1 C50.1 C52.1 C53.1 IC6.2(VIN) IC6.3(EN/UVLO) J7.1 Q2.2(D) Q3.2(D) Q4.2(D) Q5.2(D) Q6.2(D) Q8.2(D) Q9.2(D) Q10.2(D) Q20.2(D) R43.2
voltage: IC2.19(PB1) R43.1 R44.2
NetC8_1: C8.1 C46.1 IC1.2(HB)
NetC10_1: C10.1 C47.1 IC3.2(HB)
NetC12_1: C12.1 C48.1 IC4.2(HB)
NetC15_2: C15.2 C20.1 R25.1
NetC16_1: C16.1 IC6.8(SW) L1.1 R25.2
NetC16_2: C16.2 IC6.7(BST)
NetC20_2: C20.2 IC6.5(FB) R34.2 R36.1
NetC51_2: C51.2 R89.2
NetC54_2: C54.2 R90.2
NetC55_2: C55.2 R91.2
NetIC2_44: IC2.44(BOOT0) R87.1
NetIC5_1: IC5.1(VCC) R42.1
NetIC6_4: IC6.4(RON) R35.1
NetIC7_6: IC7.6(CANL) J8.1 R38.2
NetIC7_7: IC7.7(CANH) J8.2 R38.1
NetIC7_8: IC7.8(RS) R37.2
NetIC8_3: IC8.3(IN+) VR1.2(WIPER)
NetJ3_1: J3.1 R32.1
NetJ3_2: J3.2 R31.1
NetJ3_3: J3.3 R30.1
Netjst1_2: jst1.2 R85.1
NetLED1_2: LED1.2(A) R41.1
NetQ7_1: Q7.1(C) R45.1 R46.1
NetQ7_2: Q7.2(B) R47.1
NetR7_2: R7.2 Z1.1(K)
NetR10_2: R10.2 Z2.1(K)
NetR13_2: R13.2 Z3.1(K)
NetR16_2: R16.2 Z4.1(K)
NetR19_2: R19.2 Z5.1(K)
NetR22_2: R22.2 Z6.1(K)
NetR49_2: R49.2 Z7.1(K)
NetR52_2: R52.2 Z8.1(K)
NetR55_2: R55.2 Z9.1(K)
NetR58_2: R58.2 Z10.1(K)
NetR61_2: R61.2 Z11.1(K)
NetR64_2: R64.2 Z12.1(K)
NetR67_2: R67.2 Z13.1(K)
NetR70_2: R70.2 Z14.1(K)
NetR73_2: R73.2 Z15.1(K)
NetR76_2: R76.2 Z16.1(K)
NetR79_2: R79.2 Z17.1(K)
NetR82_2: R82.2 Z18.1(K)

Not connected (* = marked no-connect by the designer): IC6 6(PGOOD); IC7 5(VREF); IC9 8(4Y) 9(4A) 10(5Y) 11(5A) 12(6Y) 13(6A)

## Notes on the sheet
- CURRENT MEASUREMENT
- VOLTAGE MEASUREMENT
- (near R37) BU İKİ DİRENÇ DEĞERİNİ ÖĞREN
- 12V BUCK
- YEŞİL
- SARI
- (near IC2) MAVİ
- (near C25) 470pF (eski sistem)
- pedal voltaj bölücü
- boot
- yeşil sarı mavi olayını kontrol et
- AKIM ÖLÇÜM PİN OUT DEĞİŞTİ
- POLYGON  VE YOL BİRLEŞMESİNE BAK
- analog adc1
- acs yön
- faz renk isiimleri
- schmitt trigger
- buton
- snubber

## Library data of the parts
C1-C5 C50 C52 C53 = 100V 470uF 7.5mm cap: bulk
C6 = 50v 0.1uF elect cap
C15 = 0.1 uF C1206
C16 C20 C22-C24 C33-C35 C38 C46-C49 = 08055A150JAT2A: Capacitor; Manufacturer_Name: AVX; Datasheet Link: https://componentsearchengine.com/Datasheets/1/06031A100FAT2A.pdf; Height: 0.94mm; Manufacturer_Part_Number: 08055A150JAT2A; Mouser Part Number: 581-08055A150J; Mouser Price/Stock: https://www.mouser.co.uk/ProductDetail/AVX/08055A150JAT2A?qs=pZVDklL%2Fs8hiEua37sqbaA%3D%3D; Arrow Part Number: 08055A150JAT2A; Arrow Price/Stock: https://www.arrow.com/en/products/08055a150jat2a/avx?region=nac
C17-C19 = GRM32EC81C476KE15K: Capacitor; Manufacturer_Name: Murata Electronics; Datasheet Link: http://psearch.en.murata.com/capacitor/product/GRM32ER71E226KE15%23.pdf; Height: 2.7mm; Manufacturer_Part_Number: GRM32EC81C476KE15K; Mouser Part Number: 81-GRM32EC81C476KE5K; Mouser Price/Stock: https://www.mouser.co.uk/ProductDetail/Murata-Electronics/GRM32EC81C476KE15K?qs=pba5EUA0Y0ZfNhWUOosFbg%3D%3D; Arrow Part Number: GRM32EC81C476KE15K; Arrow Price/Stock: https://www.arrow.com/en/products/grm32ec81c476ke15k/murata-manufacturing?region=nac
C51 C54 C55 = 100nF POLYESTER CAPACITOR
IC1 IC3 IC4 = UCC27201ADR: Integrated Circuit; Manufacturer_Name: Texas Instruments; Datasheet Link: http://www.ti.com/lit/gpn/ucc27201a; Height: 1.75mm; Manufacturer_Part_Number: UCC27201ADR; Mouser Part Number: 595-UCC27201ADR; Mouser Price/Stock: https://www.mouser.co.uk/ProductDetail/Texas-Instruments/UCC27201ADR?qs=UlfnwZ2x8nSx8LpZAgWREw%3D%3D; Arrow Part Number: UCC27201ADR; Arrow Price/Stock: https://www.arrow.com/en/products/ucc27201adr/texas-instruments
IC2 = STM32F103C8T6TR: Integrated Circuit; Manufacturer_Name: STMicroelectronics; Datasheet Link: http://media.digikey.com/pdf/Data%20Sheets/ST%20Microelectronics%20PDFS/STM32F103x8,B.pdf; Height: 1.6mm; Manufacturer_Part_Number: STM32F103C8T6TR; Mouser Part Number: 511-STM32F103C8T6TR; Mouser Price/Stock: https://www.mouser.co.uk/ProductDetail/STMicroelectronics/STM32F103C8T6TR?qs=5HwTSiuA5HDxFj62n06yag%3D%3D; Arrow Part Number: STM32F103C8T6TR; Arrow Price/Stock: https://www.arrow.com/en/products/stm32f103c8t6tr/stmicroelectronics?region=nac
IC5 = ACS758LCB-100B-PFF-T: Integrated Circuit; Manufacturer_Name: Allegro Microsystems; Datasheet Link: https://www.allegromicro.com/-/media/files/datasheets/acs758-datasheet.ashx; Height: 7.1mm; Manufacturer_Part_Number: ACS758LCB-100B-PFF-T; Mouser Part Number: 250-758LCB100BPFFT; Mouser Price/Stock: https://www.mouser.co.uk/ProductDetail/Allegro-MicroSystems/ACS758LCB-100B-PFF-T?qs=pUKx8fyJudA0WtlqV%2Fcrcw%3D%3D; Arrow Part Number: ACS758LCB-100B-PFF-T; Arrow Price/Stock: https://www.arrow.com/en/products/acs758lcb-100b-pff-t/allegro-microsystems?region=nac
IC6 = LM5164DDAT: Integrated Circuit; Manufacturer_Name: Texas Instruments; Datasheet Link: https://www.mouser.be/ProductDetail/Texas-Instruments/LM5164DDAT?qs=%2Fha2pyFadujHbTcENLOIajUKDDTgjr9g9rZTNZ%252BjNiUdOtruDh%252BCOQ%3D%3D; Height: 1.7mm; Manufacturer_Part_Number: LM5164DDAT; Mouser Part Number: 595-LM5164DDAT; Mouser Price/Stock: https://www.mouser.co.uk/ProductDetail/Texas-Instruments/LM5164DDAT?qs=PqoDHHvF648Lb%252BUmbhADOg%3D%3D; Arrow Part Number: LM5164DDAT; Arrow Price/Stock: https://www.arrow.com/en/products/lm5164ddat/texas-instruments?region=nac
IC7 = MCP2551-E_SN: Integrated Circuit; Manufacturer_Name: Microchip; Manufacturer_Part_Number: MCP2551-E/SN; Datasheet Link: https://datasheet.datasheetarchive.com/originals/distributors/SFDatasheet-4/sf-00090061.pdf; Height: 1.75mm; Mouser Part Number: 579-MCP2551-E/SN; Mouser Price/Stock: https://www.mouser.co.uk/ProductDetail/Microchip-Technology-Atmel/MCP2551-E-SN?qs=Vn0zuzr35GHkGDCgnw0F9A%3D%3D; Arrow Part Number: MCP2551-E/SN; Arrow Price/Stock: https://www.arrow.com/en/products/mcp2551-esn/microchip-technology
IC8 = NCS325SN2T1G_1: Integrated Circuit; Manufacturer_Name: onsemi; Datasheet Link: https://componentsearchengine.com/Datasheets/1/NCS325SN2T1G.pdf; Height: 1.1mm; Manufacturer_Part_Number: NCS325SN2T1G; Mouser Part Number: 863-NCS325SN2T1G; Mouser Price/Stock: https://www.mouser.co.uk/ProductDetail/onsemi/NCS325SN2T1G?qs=dbuNSGnowt2g9SoYxOxXaw%3D%3D; Arrow Part Number: NCS325SN2T1G; Arrow Price/Stock: https://www.arrow.com/en/products/ncs325sn2t1g/on-semiconductor
IC9 = 74HC14DB,112: Integrated Circuit; Manufacturer_Name: Nexperia; Datasheet Link: https://assets.nexperia.com/documents/data-sheet/74HC_HCT14.pdf; Height: 1.75mm; Manufacturer_Part_Number: 74HC14DB,112; Mouser Part Number: 771-74HC14DB; Mouser Price/Stock: https://www.mouser.co.uk/ProductDetail/Nexperia/74HC14DB112/?qs=P62ublwmbi8gAnZkoIWhjA%3D%3D; Arrow Part Number: 74HC14DB,112; Arrow Price/Stock: https://www.arrow.com/en/products/74hc14db112/nexperia?region=nac
J3 = 5X HEADER
L1 = srd1006 inductor: inductor
LED1 = 150120BS75000: LED; Manufacturer_Name: Wurth Elektronik; Datasheet Link: https://katalog.we-online.de/led/datasheet/150120BS75000.pdf; Height: 0.78mm; Manufacturer_Part_Number: 150120BS75000; Mouser Part Number: 710-150120BS75000; Mouser Price/Stock: https://www.mouser.co.uk/ProductDetail/Wurth-Elektronik/150120BS75000?qs=LlUlMxKIyB1WGHUNBglvng%3D%3D
P1 = TOP BOTTOM PAD: PAD
Q2-Q6 Q8-Q20 = IXTH130N10T: n-channel mosfet
Q7 = 2N2222A: Transistor BJT NPN; Manufacturer_Name: Foshan Blue Rocket Elec; Datasheet Link: https://datasheet.lcsc.com/szlcsc/1901291437_Foshan-Blue-Rocket-Elec-2N2222A_C358533.pdf; Height: 4.7mm; Manufacturer_Part_Number: 2N2222A
R1-R24 R26-R33 R49-R88 = CR1206-F_-2R70ELF: Resistor; Manufacturer_Name: Bourns; Manufacturer_Part_Number: CR1206-F/-2R70ELF; Datasheet Link: https://mail.qq.com/cgi-bin/loginpage?autologin=n&errtype=1&clientuin=895793657&param=&sp=&tfcont=22%20serialization%3A%3Aarchive%2010%200%200%204%200%200%200%208%20authtype%201%204%209%20clientuin%209%20895793657%206%20domain%206%20qq.com%202%20vm%203%20; Height: 0.75mm; Mouser Part Number: 652-CR1206-F/2R70ELF; Mouser Price/Stock: https://www.mouser.co.uk/ProductDetail/Bourns/CR1206-F-2R70ELF?qs=W%2FMpXkg%252BdQ43a7iNS79Iog%3D%3D
R25 R34-R36 R41 R42 R45-R48 = CPF0805B100RE1: Resistor; Manufacturer_Name: TE Connectivity; Datasheet Link: http://docs-europe.electrocomponents.com/webdocs/13d1/0900766b813d116f.pdf; Height: 0.65mm; Manufacturer_Part_Number: CPF0805B100RE1; Mouser Part Number: 279-CPF0805B100RE1; Mouser Price/Stock: https://www.mouser.co.uk/ProductDetail/TE-Connectivity-Holsworthy/CPF0805B100RE1?qs=9ylKvqdyudkCWLPT1QvLZQ%3D%3D; Arrow Part Number: CPF0805B100RE1; Arrow Price/Stock: https://www.arrow.com/en/products/cpf0805b100re1/te-connectivity?region=nac
R37-R40 = CPF0805B100RE1_1: Resistor; Manufacturer_Name: TE Connectivity; Datasheet Link: https://datasheet.datasheetarchive.com/originals/distributors/DKDS-21/401696.pdf; Height: 0.65mm; Manufacturer_Part_Number: CPF0805B100RE1; Mouser Part Number: 279-CPF0805B100RE1; Mouser Price/Stock: https://www.mouser.co.uk/ProductDetail/TE-Connectivity-Holsworthy/CPF0805B100RE1?qs=9ylKvqdyudkCWLPT1QvLZQ%3D%3D; Arrow Part Number: CPF0805B100RE1; Arrow Price/Stock: https://www.arrow.com/en/products/cpf0805b100re1/te-connectivity?region=nac
R43 R44 = CR1206-F_-2R70ELF_1: Resistor; Manufacturer_Name: Bourns; Manufacturer_Part_Number: CR1206-F/-2R70ELF; Datasheet Link: https://mail.qq.com/cgi-bin/loginpage?autologin=n&errtype=1&clientuin=895793657&param=&sp=&tfcont=22%20serialization%3A%3Aarchive%2010%200%200%204%200%200%200%208%20authtype%201%204%209%20clientuin%209%20895793657%206%20domain%206%20qq.com%202%20vm%203%20; Height: 0.75mm; Mouser Part Number: 652-CR1206-F/2R70ELF; Mouser Price/Stock: https://www.mouser.co.uk/ProductDetail/Bourns/CR1206-F-2R70ELF?qs=W%2FMpXkg%252BdQ43a7iNS79Iog%3D%3D
S1 = 1437566-4: Switch; Manufacturer_Name: TE Connectivity; Datasheet Link: https://www.te.com/commerce/DocumentDelivery/DDEController?Action=showdoc&DocId=Customer+Drawing%7F1437566-3%7FC2%7Fpdf%7FEnglish%7FENG_CD_1437566-3_C7F14375662_1437566_3_1_c.dwg.pdf%-4; Height: 4.87mm; Manufacturer_Part_Number: 1437566-4; Mouser Part Number: N/A; Mouser Price/Stock: https://www.mouser.co.uk/ProductDetail/TE-Connectivity-Alcoswitch/1437566-4?qs=xoXDFGdkQ2nbcMrTmW1sHA%3D%3D; Arrow Part Number: 1437566-4; Arrow Price/Stock: https://www.arrow.com/en/products/1437566-4/te-connectivity?region=europe
U1 = LD108633 3.3V DPAK: LD108633 3.3V REGULATOR
U2 = L7805-DPAK_1: L7805 5V REGULATOR. SMD PAKET
VR1 = 3296W-1-252LF: Variable Resistor; Manufacturer_Name: Bourns; Datasheet Link: https://www.bourns.com/pdfs/3296.pdf; Manufacturer_Part_Number: 3296W-1-252LF; Mouser Part Number: 652-3296W-1-252LF; Mouser Price/Stock: https://www.mouser.co.uk/ProductDetail/Bourns/3296W-1-252LF?qs=VW5eOWd7Luy89Xw%2FKwu%2Fxg%3D%3D; Arrow Part Number: 3296W-1-252LF; Arrow Price/Stock: https://www.arrow.com/en/products/3296w-1-252lf/bourns?region=nac
Z1-Z18 = 3SMAJ5927B-TP: Zener Diode; Manufacturer_Name: MCC; Datasheet Link: https://www.mccsemi.com/pdf/Products/3SMAJ5918B-3SMAJ5956B(SMA).pdf; Height: 2.44mm; Manufacturer_Part_Number: 3SMAJ5927B-TP; Mouser Part Number: 833-3SMAJ5927B-TP; Mouser Price/Stock: https://www.mouser.co.uk/ProductDetail/Micro-Commercial-Components-MCC/3SMAJ5927B-TP?qs=ZNK0BnemlqF3Ltqs8dFZzA%3D%3D